# Altium schematic sheet [1] - MCU-CORE.SchDoc
size A
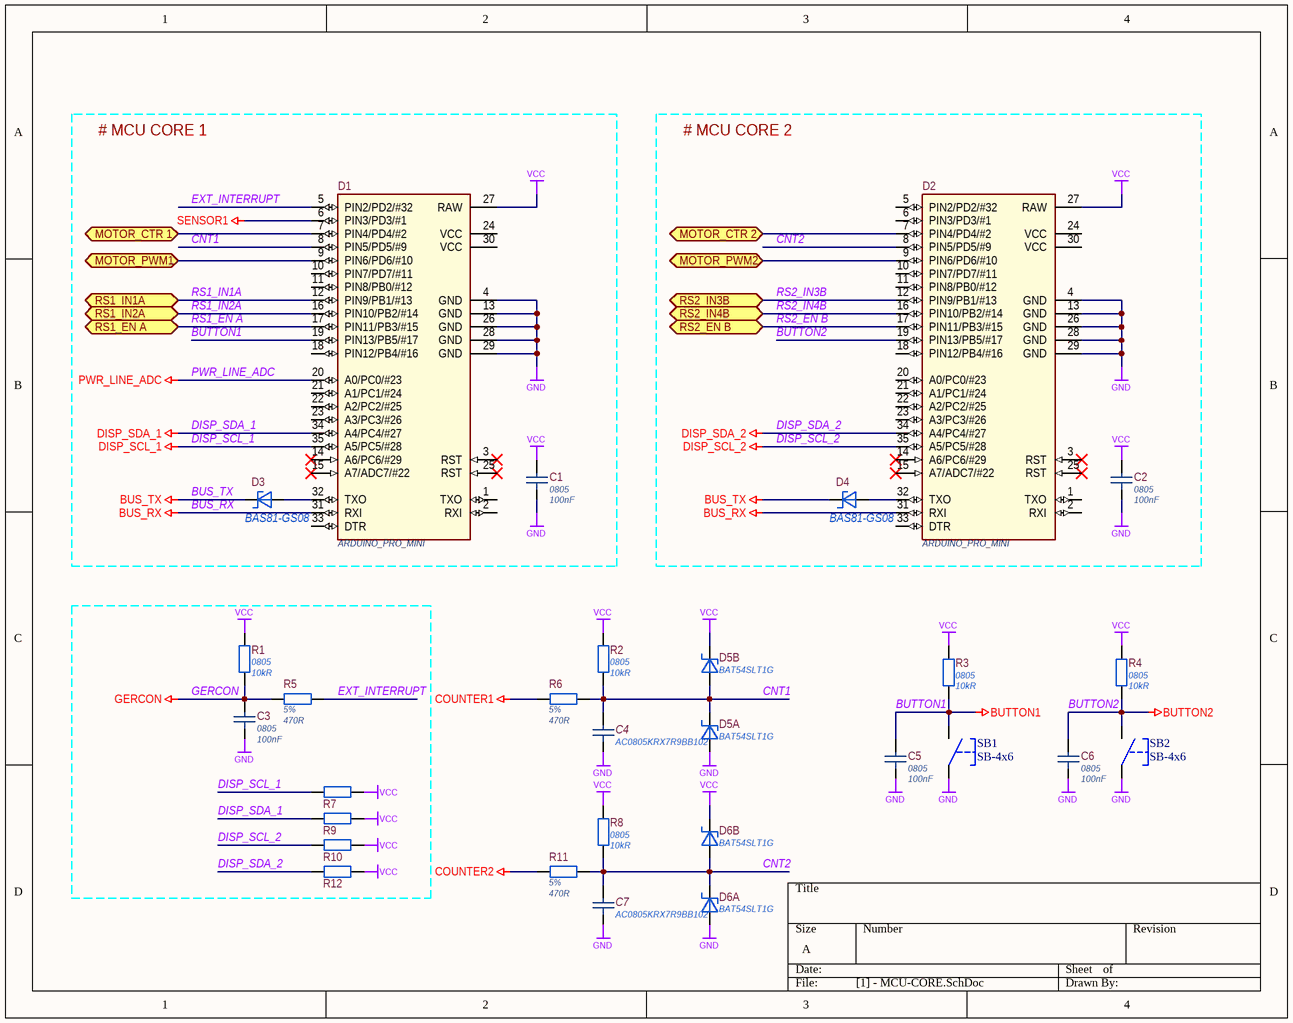
[diagram p0: [1] - MCU-CORE.SchDoc]

## Parts
C1  Case/Package: 0805  Capacitance: 100nF  [CH0805C]  (hidden comment: AC0805KRX7R9BB104)
C2  Case/Package: 0805  Capacitance: 100nF  [CH0805C]  (hidden comment: AC0805KRX7R9BB104)
C3  Case/Package: 0805  Capacitance: 100nF  [CH0805C]  (hidden comment: AC0805KRX7R9BB104)
C4  AC0805KRX7R9BB102  [CH0805C]
C5  Case/Package: 0805  Capacitance: 100nF  [CH0805C]  (hidden comment: AC0805KRX7R9BB104)
C6  Case/Package: 0805  Capacitance: 100nF  [CH0805C]  (hidden comment: AC0805KRX7R9BB104)
C7  AC0805KRX7R9BB102  [CH0805C]
D1  ARDUINO_PRO_MINI  [DEV-11114]
D2  ARDUINO_PRO_MINI  [DEV-11114]
D3  BAS81-GS08  [SOD-80]
D4  BAS81-GS08  [SOD-80]
D5  BAT54SLT1G  [SOT23-3]  (parts A,B of 2)
D6  BAT54SLT1G  [SOT23-3]  (parts A,B of 2)
R1  Case/Package: 0805  Resistance: 10kR  [CH0805R]  (hidden comment: RC0805JR-0710KL)
R2  Case/Package: 0805  Resistance: 10kR  [CH0805R]  (hidden comment: RC0805JR-0710KL)
R3  Case/Package: 0805  Resistance: 10kR  [CH0805R]  (hidden comment: RC0805JR-0710KL)
R4  Case/Package: 0805  Resistance: 10kR  [CH0805R]  (hidden comment: RC0805JR-0710KL)
R5  Tolerance: 5%  Resistance: 470R  [CH0805R]  (hidden comment: RC0805JR-07470RL)
R6  Tolerance: 5%  Resistance: 470R  [CH0805R]  (hidden comment: RC0805JR-07470RL)
R7  RC0805JR-074K7L  [CH0805R]  (value not drawn)
R8  Case/Package: 0805  Resistance: 10kR  [CH0805R]  (hidden comment: RC0805JR-0710KL)
R9  RC0805JR-074K7L  [CH0805R]  (value not drawn)
R10  RC0805JR-074K7L  [CH0805R]  (value not drawn)
R11  Tolerance: 5%  Resistance: 470R  [CH0805R]  (hidden comment: RC0805JR-07470RL)
R12  RC0805JR-074K7L  [CH0805R]  (value not drawn)
SB1  SB-4x6  [Button-6*4.5]
SB2  SB-4x6  [Button-6*4.5]

## Blocks framed on the sheet
# MCU CORE 1: C1 D1 D3
# MCU CORE 2: C2 D2 D4

## Ports
MOTOR_CTR 1 (bidir), MOTOR_CTR 2 (bidir), MOTOR_PWM1 (bidir), MOTOR_PWM2 (bidir), RS1_EN A (bidir), RS1_IN1A (bidir), RS1_IN2A (bidir), RS2_EN B (bidir), RS2_IN3B (bidir), RS2_IN4B (bidir)

## Nets
BUS_RX: D1.31(RXI) D2.31(RXI)
BUS_TX: D3.2(K) D4.2(K)
BUTTON1: C5.1 D1.19(PIN13/PB5/#17) R3.1 SB1.2
BUTTON2: C6.1 D2.19(PIN13/PB5/#17) R4.1 SB2.2
COUNTER1: R6.1
COUNTER2: R11.1
DISP_SCL_1: D1.35(A5/PC5/#28) R7.2
DISP_SCL_2: D2.35(A5/PC5/#28) R10.2
DISP_SDA_1: D1.34(A4/PC4/#27) R9.2
DISP_SDA_2: D2.34(A4/PC4/#27) R12.2
GERCON: C3.1 R1.1 R5.1
GND: C1.2 C2.2 C3.2 C4.2 C5.2 C6.2 C7.2 D1.4(GND) D1.13(GND) D1.26(GND) D1.28(GND) D1.29(GND) D2.4(GND) D2.13(GND) D2.26(GND) D2.28(GND) D2.29(GND) D5.1 D6.1 SB1.1 SB2.1
PWR_LINE_ADC: D1.20(A0/PC0/#23)
SENSOR1: D1.6(PIN3/PD3/#1)
VCC: C1.1 C2.1 D1.27(RAW) D2.27(RAW) D5.2 D6.2 R1.2 R2.2 R3.2 R4.2 R7.1 R8.2 R9.1 R10.1 R12.1
CNT1: C4.1 D1.8(PIN5/PD5/#9) D5.3 R2.1 R6.2
CNT2: C7.1 D2.8(PIN5/PD5/#9) D6.3 R8.1 R11.2
EXT_INTERRUPT: D1.5(PIN2/PD2/#32) R5.2
MOTOR_CTR 1: D1.7(PIN4/PD4/#2) ; port MOTOR_CTR 1
MOTOR_CTR 2: D2.7(PIN4/PD4/#2) ; port MOTOR_CTR 2
MOTOR_PWM1: D1.9(PIN6/PD6/#10) ; port MOTOR_PWM1
MOTOR_PWM2: D2.9(PIN6/PD6/#10) ; port MOTOR_PWM2
RS1_EN A: D1.17(PIN11/PB3/#15) ; port RS1_EN A
RS1_IN1A: D1.12(PIN9/PB1/#13) ; port RS1_IN1A
RS1_IN2A: D1.16(PIN10/PB2/#14) ; port RS1_IN2A
RS2_EN B: D2.17(PIN11/PB3/#15) ; port RS2_EN B
RS2_IN3B: D2.12(PIN9/PB1/#13) ; port RS2_IN3B
RS2_IN4B: D2.16(PIN10/PB2/#14) ; port RS2_IN4B
NetD1_32: D1.32(TXO) D3.1(A)
NetD2_32: D2.32(TXO) D4.1(A)

Not connected (* = marked no-connect by the designer): D1 1(TXO) 2(RXI) 3(RST)* 10(PIN7/PD7/#11) 11(PIN8/PB0/#12) 14(A6/PC6/#29)* 15(A7/ADC7/#22)* 18(PIN12/PB4/#16) 21(A1/PC1/#24) 22(A2/PC2/#25) 23(A3/PC3/#26) 24(VCC) 25(RST)* 30(VCC) 33(DTR); D2 1(TXO) 2(RXI) 3(RST)* 5(PIN2/PD2/#32) 6(PIN3/PD3/#1) 10(PIN7/PD7/#11) 11(PIN8/PB0/#12) 14(A6/PC6/#29)* 15(A7/ADC7/#22)* 18(PIN12/PB4/#16) 20(A0/PC0/#23) 21(A1/PC1/#24) 22(A2/PC2/#25) 23(A3/PC3/#26) 24(VCC) 25(RST)* 30(VCC) 33(DTR)

## Library data of the parts
C1-C3 C5 C6 = AC0805KRX7R9BB104: 0.10µF 50V Ceramic Capacitor X7R 0805 (2012 Metric) 0.079" L x 0.049" W (2.00mm x 1.25mm); Manufacturer 1: Yageo; Tolerance: 10%; Supplier 1: Digi-Key; Manufacturer Part Number 1: AC0805KRX7R9BB104; Stock 1: 18765; Pricing 1: 1=0.23000, 10=0.15600, 100=0.07930, 500=0.05424, 1000=0.04799 (USD); RoHS: Yes; Mount: Surface Mount; Min Operating Temperature: -55°C; Max Operating Temperature: 125°C; Packaging: Tape and Reel; Voltage Rating: 50V; Length: 0.079inch; Width: 0.049inch; Thickness: 0.028inch; Ratings: AEC-Q200; Lead Free: Lead Free; ComponentLink1URL: http://www.yageo.com/documents/recent/UPY-AC_NP0X7R_16V-to-630V_12.pdf?src-supplier=Digi-Key; ComponentLink1Description: http://www.yageo.com/documents/recent/UPY-AC_NP0X7R_16V-to-630V_12.pdf?src-supplier=Digi-Key; Supplier Part Number 1: 311-3037-1-ND; Supplier 2: Digi-Key; Supplier Part Number 2: 311-1939-2-ND
C4 C7 = AC0805KRX7R9BB102: CAP CER 1000PF 50V X7R 0805; Manufacturer 1: Yageo; Supplier 1: Digi-Key; Manufacturer Part Number 1: AC0805KRX7R9BB102; Stock 1: 6153; Pricing 1: 1=0.21000, 10=0.14500, 100=0.07340, 500=0.05020, 1000=0.04440 (USD); RoHS: No; Lead Free: Lead Free; Supplier Part Number 1: 311-3173-1-ND
D1 D2 = ARDUINO_PRO_MINI: ATMEGA328 ARDUINO PRO MINI 3.3V; Manufacturer 1: SparkFun; Supplier 1: Digi-Key; Manufacturer Part Number 1: DEV-11114; Stock 1: 569; Pricing 1: 1=9.95000 (USD); RoHS: No; Supplier Part Number 1: 1568-1054-ND
D3 D4 = BAS81-GS08: Diode Small Signal Schottky 40V 0.03A 2-Pin Mini-MELF SOD-80 T/R; Manufacturer 1: Vishay Semiconductors; Max Surge Current: 500mA; Forward Voltage: 1V; Forward Current: 30mA; Peak Reverse Current: 200nA; Element Configuration: Single; Current Rating: 30A; Supplier 1: Digi-Key; Manufacturer Part Number 1: BAS81-GS08; Stock 1: 12175; Pricing 1: 1=0.37000, 10=0.29900, 100=0.15850, 500=0.10428, 1000=0.07092 (USD); RoHS: Yes; Mount: Surface Mount; Number of Pins: 2; Contact Plating: Tin,Silver; Min Operating Temperature: -65°C; Max Operating Temperature: 125°C; Packaging: Tape and Reel; Package Quantity: 2500; Average Rectified Current: 30mA; Max Reverse Leakage Current: 200nA; Peak Non-Repetitive Surge Current: 500mA; Max Repetitive Reverse Voltage (Vrrm): 40V; Max Reverse Voltage (DC): 40V; Max Forward Surge Current (Ifsm): 500mA; Diameter: 1.6mm; Length: 3.7mm; Height: 1.6mm; Width: 1.6mm; Radiation Hardening: No; REACH SVHC: Unknown; ComponentLink1URL: https://datasheet.ciiva.com/1240/1698309-1240528.pdf?src-supplier=Newark; ComponentLink1Description: https://datasheet.ciiva.com/1240/1698309-1240528.pdf?src-supplier=Newark; ComponentLink2URL: https://datasheet.ciiva.com/15144/getdatasheetpartid-45935-15144179.pdf?src-supplier=Verical; ComponentLink2Description: https://datasheet.ciiva.com/15144/getdatasheetpartid-45935-15144179.pdf?src-supplier=Verical; ComponentLink3URL: https://datasheet.ciiva.com/4245/bas81-4245446.pdf?src-supplier=Arrow; ComponentLink3Description: https://datasheet.ciiva.com/4245/bas81-4245446.pdf?src-supplier=Arrow; ComponentLink4URL: https://datasheet.ciiva.com/17076/bas81-gs08-17076266.pdf?src-supplier=Allied+Electronics; ComponentLink4Description: https://datasheet.ciiva.com/17076/bas81-gs08-17076266.pdf?src-supplier=Allied+Electronics; ComponentLink5URL: https://datasheet.ciiva.com/26294/1698309-26294950.pdf?src-supplier=Element14; ComponentLink5Description: https://datasheet.ciiva.com/26294/1698309-26294950.pdf?src-supplier=Element14; ComponentLink6URL: https://datasheet.ciiva.com/16941/70061832-16941562.pdf?src-supplier=Allied+Electronics; ComponentLink6Description: https://datasheet.ciiva.com/16941/70061832-16941562.pdf?src-supplier=Allied+Electronics; Supplier Part Number 1: BAS81-GS08GICT-ND
D5 D6 = BAT54SLT1G: DIODE ARRAY SCHOTTKY 30V SOT23-3; Manufacturer 1: ON Semiconductor; Forward Current: 200mA; Max Surge Current: 600mA; Forward Voltage: 800mV; Peak Reverse Current: 2uA; Recovery Time: 5ns; Element Configuration: Dual; Peak Non-Repetitive Surge Current: 1A; Power Dissipation: 225mW; Capacitance: 10pF; Supplier 1: Digi-Key; Manufacturer Part Number 1: BAT54SLT1G; Stock 1: 1663959; Pricing 1: 1=0,15000, 10=0,13700, 100=0,07440, 500=0,04576, 1000=0,03120 (USD); RoHS: Yes; Case/Package: SOT-23-3; Number of Pins: 3; Contact Plating: Tin,Matte; Min Operating Temperature: -55°C; Max Operating Temperature: 150°C; Packaging: Tape and Reel; Max Repetitive Reverse Voltage (Vrrm): 30V; Package Quantity: 3000; Average Rectified Current: 200mA; Reverse Recovery Time: 5ns; Max Reverse Leakage Current: 2uA; Current Rating: 200mA; Voltage Rating (DC): 30V; Max Reverse Voltage (DC): 30V; Max Forward Surge Current (Ifsm): 600mA; Length: 2.9mm; Height: 0.94mm; Width: 1.3mm; Radiation Hardening: No; Lead Free: Lead Free; Halogen Free: Halogen Free; REACH SVHC: No SVHC; ComponentLink1URL: https://datasheet.ciiva.com/1180/bat54slt1-d-1180304.pdf?src-supplier=Element14; ComponentLink1Description: https://datasheet.ciiva.com/1180/bat54slt1-d-1180304.pdf?src-supplier=Element14; ComponentLink2URL: https://datasheet.ciiva.com/1240/bat54slt1-d-1240837.pdf?src-supplier=Newark; ComponentLink2Description: https://datasheet.ciiva.com/1240/bat54slt1-d-1240837.pdf?src-supplier=Newark; ComponentLink3URL: https://datasheet.ciiva.com/4714/bat54slt1-d-103997-4714086.pdf?src-supplier=Mouser; ComponentLink3Description: https://datasheet.ciiva.com/4714/bat54slt1-d-103997-4714086.pdf?src-supplier=Mouser; ComponentLink4URL: https://datasheet.ciiva.com/1180/bat54slt1-d-1180305.pdf?src-supplier=Element14; ComponentLink4Description: https://datasheet.ciiva.com/1180/bat54slt1-d-1180305.pdf?src-supplier=Element14; ComponentLink5URL: https://datasheet.ciiva.com/14558/70099484-14558437.pdf?src-supplier=Allied+Electronics; ComponentLink5Description: https://datasheet.ciiva.com/14558/70099484-14558437.pdf?src-supplier=Allied+Electronics; ComponentLink6URL: https://datasheet.ciiva.com/905/bat54slt1-d-905830.pdf?src-supplier=Digi-Key; ComponentLink6Description: https://datasheet.ciiva.com/905/bat54slt1-d-905830.pdf?src-supplier=Digi-Key; ComponentLink7URL: https://datasheet.ciiva.com/905/bat54slt1-d-905831.pdf?src-supplier=Digi-Key; ComponentLink7Description: https://datasheet.ciiva.com/905/bat54slt1-d-905831.pdf?src-supplier=Digi-Key; ComponentLink8URL: https://datasheet.ciiva.com/905/bat54slt1-d-905832.pdf?src-supplier=Digi-Key; ComponentLink8Description: https://datasheet.ciiva.com/905/bat54slt1-d-905832.pdf?src-supplier=Digi-Key; ComponentLink9URL: https://datasheet.ciiva.com/8299/bat54slt1-d-8299982.pdf?src-supplier=Avnet; ComponentLink9Description: https://datasheet.ciiva.com/8299/bat54slt1-d-8299982.pdf?src-supplier=Avnet; Supplier Part Number 1: BAT54SLT1GOSCT-ND
R1-R4 R8 = RC0805JR-0710KL: RES SMD 10K OHM 5% 1/8W 0805; Manufacturer 1: Yageo; Power Rating: 125mW; Temperature Coefficient: 100ppm/°C; Voltage Rating: 150V; Supplier 1: Digi-Key; Manufacturer Part Number 1: RC0805JR-0710KL; Pricing 1: 1=0.10000, 10=0.03600, 100=0.01460, 1000=0.00654, 2500=0.00568 (USD); Contact Plating: Tin,Matte; Case Code (Imperial): 0805; Case Code (Metric): 2012; Min Operating Temperature: -55°C; Max Operating Temperature: 155°C; Composition: Thick Film; Tolerance: 5%; Packaging: Tape and Reel; Termination: SMD/SMT; Military Standard: Not; Length: 2mm; Height: 0.5mm; Width: 1.25mm; Depth: 1.25mm; Radiation Hardening: No; REACH SVHC: Unknown; Lead Free: Lead Free; ComponentLink1URL: https://datasheet.ciiva.com/7983/444164-7983765.pdf?src-supplier=Element14; ComponentLink1Description: https://datasheet.ciiva.com/7983/444164-7983765.pdf?src-supplier=Element14; ComponentLink2URL: https://datasheet.ciiva.com/7941/444164-7941870.pdf?src-supplier=Element14; ComponentLink2Description: https://datasheet.ciiva.com/7941/444164-7941870.pdf?src-supplier=Element14; ComponentLink3URL: https://datasheet.ciiva.com/7941/444164-7941871.pdf?src-supplier=Element14; ComponentLink3Description: https://datasheet.ciiva.com/7941/444164-7941871.pdf?src-supplier=Element14; Supplier Part Number 1: 311-10KARCT-ND; Stock 1: 13413905; RoHS: Yes
R5 R6 R11 = RC0805JR-07470RL: RES SMD 470 OHM 5% 1/8W 0805; Manufacturer 1: Yageo; Power Rating: 125mW; Temperature Coefficient: 100ppm/°C; Voltage Rating: 150V; Supplier 1: Digi-Key; Manufacturer Part Number 1: RC0805JR-07470RL; Stock 1: 1884733; Pricing 1: 1=0.10000, 10=0.03600, 100=0.01460, 1000=0.00654, 2500=0.00568 (USD); RoHS: Yes; Case/Package: 0805; Contact Plating: Tin,Matte,Lead; Case Code (Imperial): 0805; Case Code (Metric): 2012; Min Operating Temperature: -55°C; Max Operating Temperature: 155°C; Packaging: Tape and Reel; Composition: Thick Film; Termination: SMD/SMT; Military Standard: Not; Length: 2mm; Depth: 1.25mm; Radiation Hardening: No; REACH SVHC: Unknown; Lead Free: Lead Free; ComponentLink1URL: https://datasheet.ciiva.com/2456/rc080520pb20free-2456048.pdf?src-supplier=Digi-Key; ComponentLink1Description: https://datasheet.ciiva.com/2456/rc080520pb20free-2456048.pdf?src-supplier=Digi-Key; ComponentLink2URL: https://datasheet.ciiva.com/15190/getdatasheetpartid-330937-15190054.pdf?src-supplier=Verical; ComponentLink2Description: https://datasheet.ciiva.com/15190/getdatasheetpartid-330937-15190054.pdf?src-supplier=Verical; ComponentLink3URL: https://datasheet.ciiva.com/12667/rc0805-12667416.pdf?src-supplier=Mouser; ComponentLink3Description: https://datasheet.ciiva.com/12667/rc0805-12667416.pdf?src-supplier=Mouser; ComponentLink4URL: https://datasheet.ciiva.com/16740/rc0805-16740745.pdf?src-supplier=Future+Electronics; ComponentLink4Description: https://datasheet.ciiva.com/16740/rc0805-16740745.pdf?src-supplier=Future+Electronics; ComponentLink5URL: https://datasheet.ciiva.com/7941/442941-7941965.pdf?src-supplier=Element14; ComponentLink5Description: https://datasheet.ciiva.com/7941/442941-7941965.pdf?src-supplier=Element14; ComponentLink6URL: https://datasheet.ciiva.com/7941/442941-7941966.pdf?src-supplier=Element14; ComponentLink6Description: https://datasheet.ciiva.com/7941/442941-7941966.pdf?src-supplier=Element14; ComponentLink7URL: https://datasheet.ciiva.com/46395/444164-46395134.pdf?src-supplier=Element14; ComponentLink7Description: https://datasheet.ciiva.com/46395/444164-46395134.pdf?src-supplier=Element14; Supplier Part Number 1: 311-470ARCT-ND
R7 R9 R10 R12 = RC0805JR-074K7L: RES SMD 4.7K OHM 5% 1/8W 0805; Manufacturer 1: Yageo; Resistance: 4.7kR; Temperature Coefficient: 100ppm/°C; Power Rating: 125mW; Voltage Rating: 150V; Supplier 1: Digi-Key; Manufacturer Part Number 1: RC0805JR-074K7L; Stock 1: 3389846; Pricing 1: 1=0.10000, 10=0.03600, 100=0.01460, 1000=0.00654, 2500=0.00568 (USD); RoHS: Yes; Case/Package: Molded; Contact Plating: Tin,Lead,Matte; Case Code (Imperial): 0805; Case Code (Metric): 2012; Min Operating Temperature: -55°C; Max Operating Temperature: 155°C; Tolerance: 5%; Composition: Thick Film; Packaging: Tape and Reel; Termination: SMD/SMT; Military Standard: Not; Length: 2mm; Depth: 1.25mm; Radiation Hardening: No; REACH SVHC: Unknown; Lead Free: Lead Free; ComponentLink1URL: https://datasheet.ciiva.com/7941/442941-7941974.pdf?src-supplier=Element14; ComponentLink1Description: https://datasheet.ciiva.com/7941/442941-7941974.pdf?src-supplier=Element14; ComponentLink2URL: https://datasheet.ciiva.com/7941/442941-7941973.pdf?src-supplier=Element14; ComponentLink2Description: https://datasheet.ciiva.com/7941/442941-7941973.pdf?src-supplier=Element14; ComponentLink3URL: https://datasheet.ciiva.com/17486/rc0805-17486827.pdf?src-supplier=Future+Electronics; ComponentLink3Description: https://datasheet.ciiva.com/17486/rc0805-17486827.pdf?src-supplier=Future+Electronics; ComponentLink4URL: https://datasheet.ciiva.com/12667/rc0805-12667037.pdf?src-supplier=Mouser; ComponentLink4Description: https://datasheet.ciiva.com/12667/rc0805-12667037.pdf?src-supplier=Mouser; Supplier Part Number 1: 311-4.7KARCT-ND